# Altium schematic sheet PWR_MCU.SchDoc
size 420 x 297 mm; Address1: Address1; Address2: Address2; Address3: Address3; Address4: Address4; DocumentNumber: АБВГ.123456.001 Э3; SheetNumber: 1; SheetTotal: 2; Scale: 1:1; DocumentType: Схема электрическая принципиальная; FirstReferrence: АБВГ.123456.001
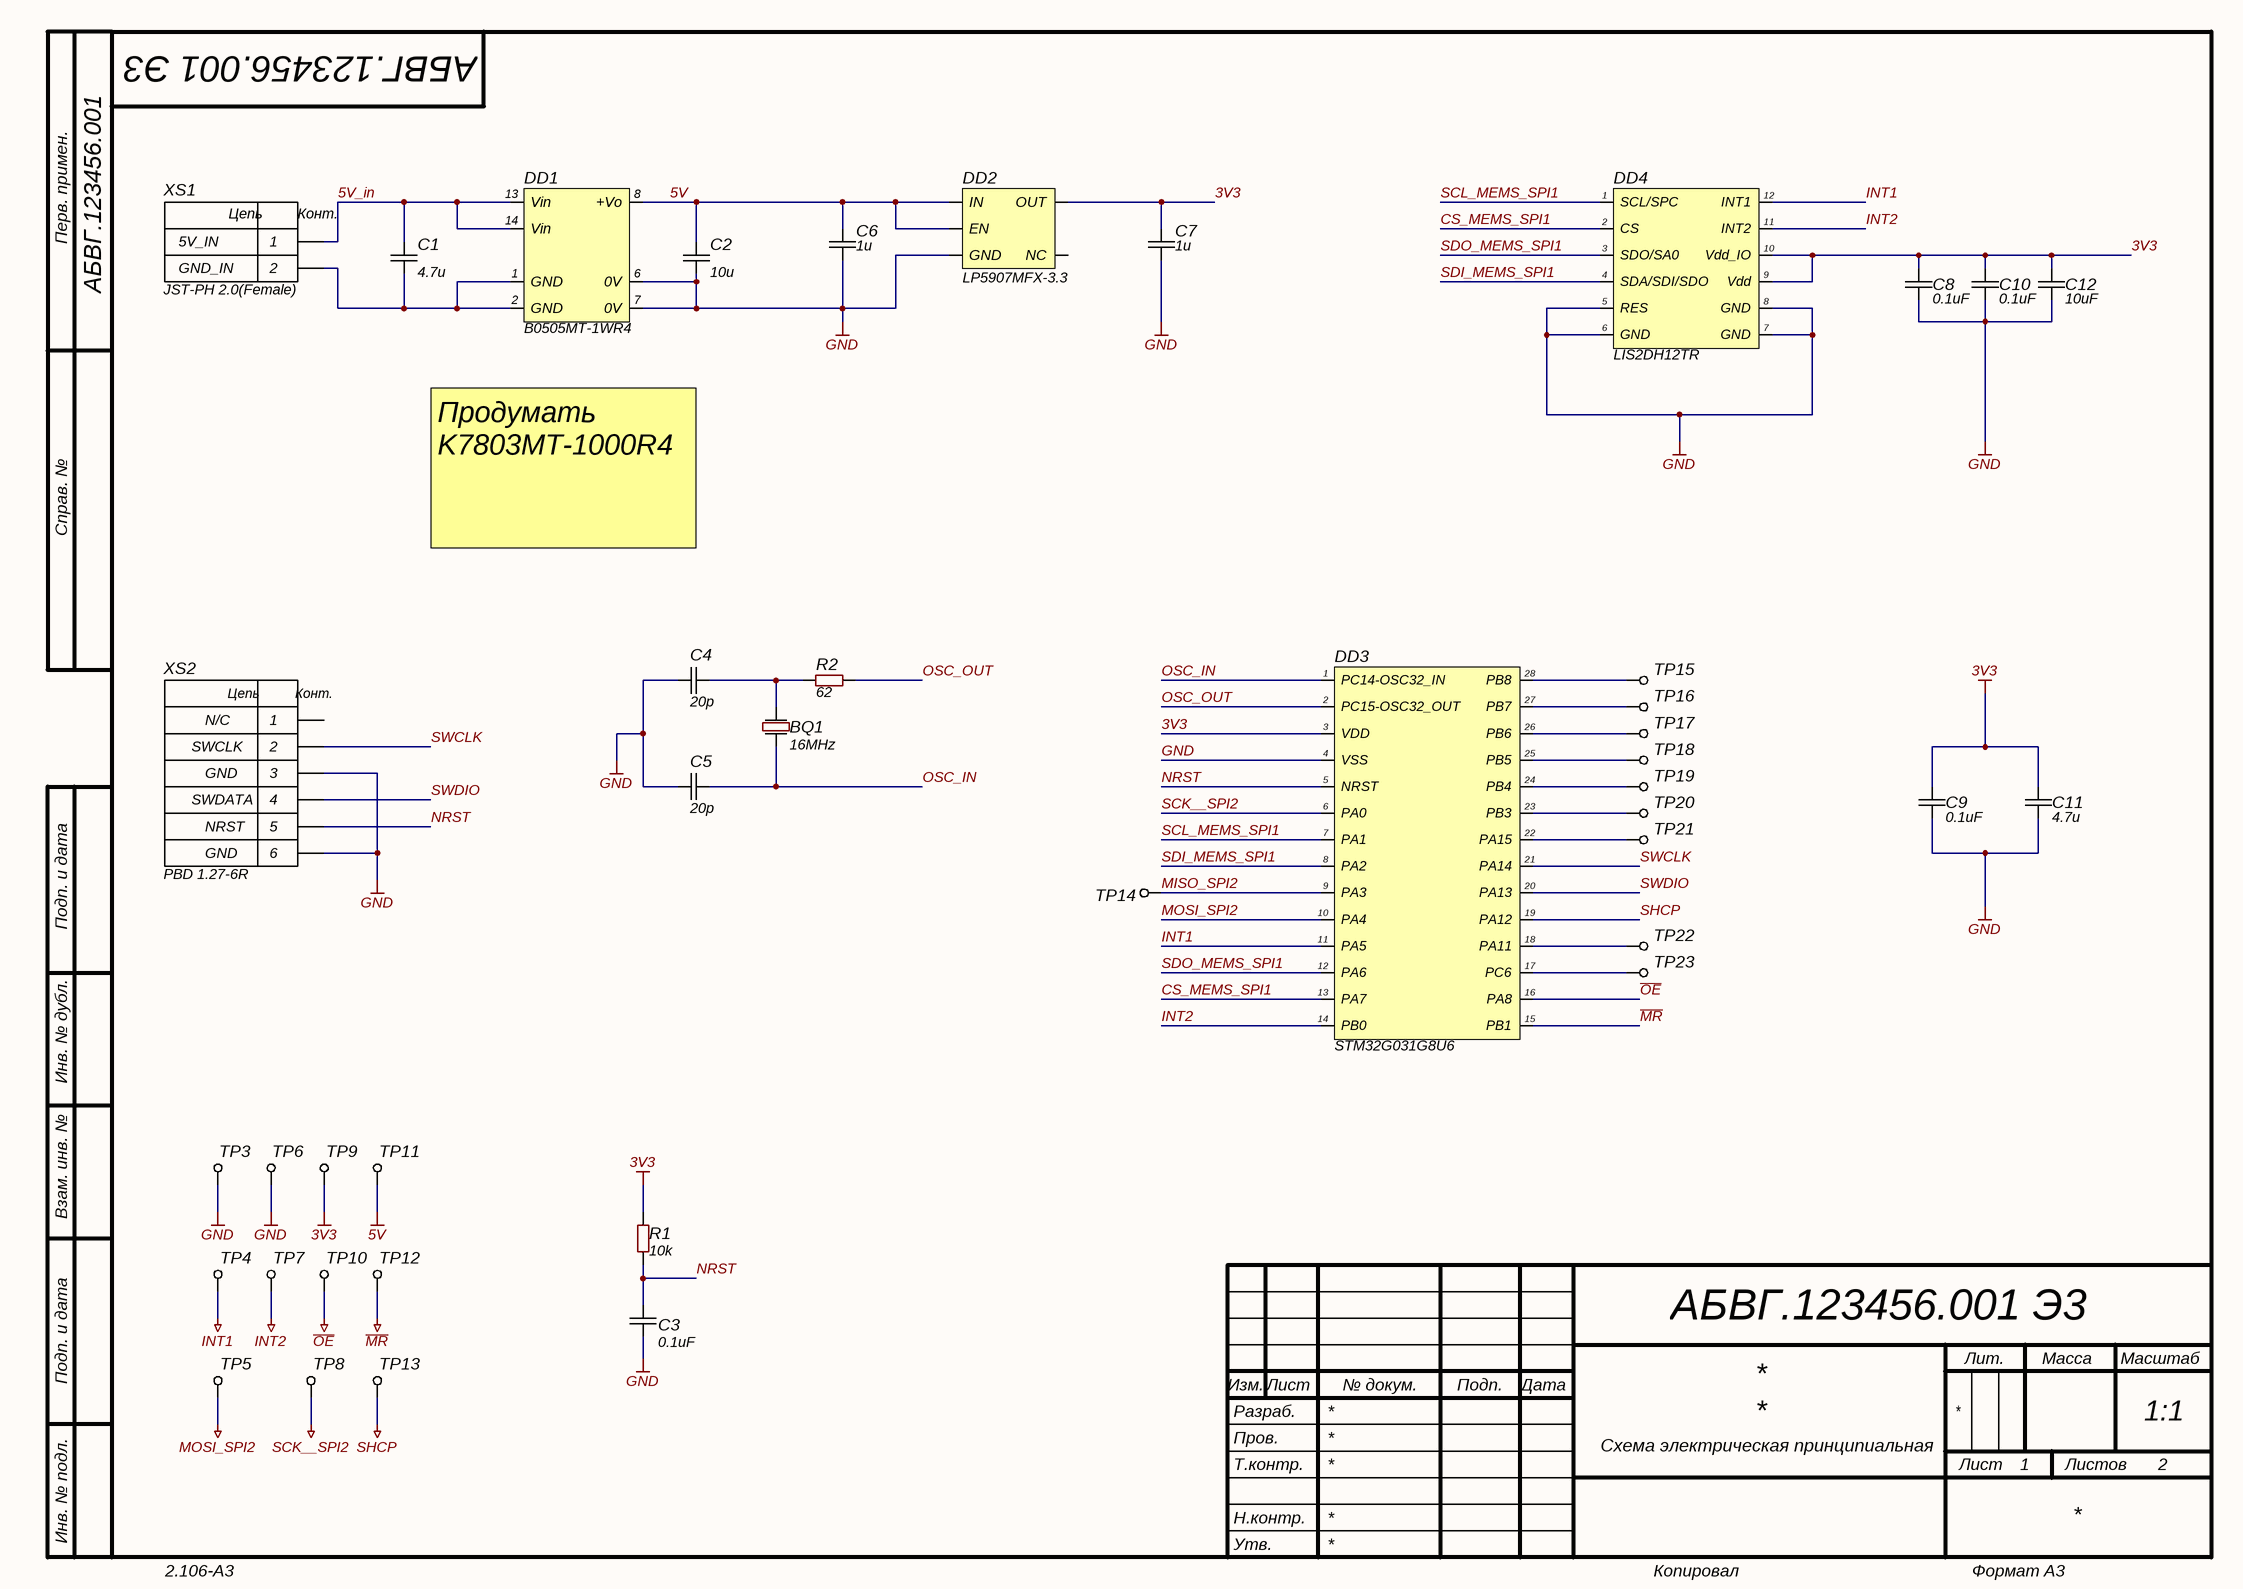
[diagram p0: PWR_MCU.SchDoc]

## Parts
BQ1  Frequency: 16MHz  [OSC: 3225]  (hidden comment: SMD3225-16.000MHz)
C1  value 4.7u  [CAP: 0805]
C2  value 10u  [CAP: 0805]
C3  value 0.1uF  [CAP: 0603]
C4  value 20p  [CAP: 0603]  (hidden comment: 0603   20 пФ ± 10 % X7R 10В)
C5  value 20p  [CAP: 0603]  (hidden comment: 0603   20 пФ ± 10 % X7R 10В)
C6  value 1u  [CAP: 0603]  (hidden comment: 0603   1 мкФ ± 10 % X7R 16В)
C7  value 1u  [CAP: 0603]  (hidden comment: 0603   1 мкФ ± 10 % X7R 16В)
C8  value 0.1uF  [CAP: 0603]
C9  value 0.1uF  [CAP: 0603]
C10  value 0.1uF  [CAP: 0603]
C11  value 4.7u  [CAP: 0603]
C12  value 10uF  [CAP: 0603]
DD1  B0505MT-1WR4  [B0505MT-1WR4]
DD2  LP5907MFX-3.3  [SOT23-5]
DD3  STM32G031G8U6  [28-UFQFPN]
DD4  LIS2DH12TR  [12-LGA]
R1  value 10k  [RES: 0603]
R2  value 62  [RES: 0603]  (hidden comment: 0603 62 Ом ± 5 %)
TP3  Testpoint_HS1mm  [TestPoint(without hole)]  (value not drawn)
TP4  Testpoint_HS1mm  [TestPoint(without hole)]  (value not drawn)
TP5  Testpoint_HS1mm  [TestPoint(without hole)]  (value not drawn)
TP6  Testpoint_HS1mm  [TestPoint(without hole)]  (value not drawn)
TP7  Testpoint_HS1mm  [TestPoint(without hole)]  (value not drawn)
TP8  Testpoint_HS1mm  [TestPoint(without hole)]  (value not drawn)
TP9  Testpoint_HS1mm  [TestPoint(without hole)]  (value not drawn)
TP10  Testpoint_HS1mm  [TestPoint(without hole)]  (value not drawn)
TP11  Testpoint_HS1mm  [TestPoint(without hole)]  (value not drawn)
TP12  Testpoint_HS1mm  [TestPoint(without hole)]  (value not drawn)
TP13  Testpoint_HS1mm  [TestPoint(without hole)]  (value not drawn)
TP14  Testpoint_HS1mm  [TestPoint(without hole)]  (value not drawn)
TP15  Testpoint_HS1mm  [TestPoint(without hole)]  (value not drawn)
TP16  Testpoint_HS1mm  [TestPoint(without hole)]  (value not drawn)
TP17  Testpoint_HS1mm  [TestPoint(without hole)]  (value not drawn)
TP18  Testpoint_HS1mm  [TestPoint(without hole)]  (value not drawn)
TP19  Testpoint_HS1mm  [TestPoint(without hole)]  (value not drawn)
TP20  Testpoint_HS1mm  [TestPoint(without hole)]  (value not drawn)
TP21  Testpoint_HS1mm  [TestPoint(without hole)]  (value not drawn)
TP22  Testpoint_HS1mm  [TestPoint(without hole)]  (value not drawn)
TP23  Testpoint_HS1mm  [TestPoint(without hole)]  (value not drawn)
XS1  JST-PH 2.0(Female)  [JST-PH 2.0(Female)]
XS2  PBD 1.27-6R  [CON: PLLD-6R(1.27)]

## Nets
3V3: C7.2 C8.2 C9.2 C10.2 C11.2 C12.2 DD2.5(OUT) DD3.3(VDD) DD4.9(Vdd) DD4.10(Vdd_IO) R1.2 TP9.1
5V: C2.2 C6.2 DD1.8(+Vo) DD2.1(IN) DD2.3(EN) TP11.1
GND: C2.1 C3.1 C4.2 C5.2 C6.1 C7.1 C8.1 C9.1 C10.1 C11.1 C12.1 DD1.6(0V) DD1.7(0V) DD2.2(GND) DD3.4(VSS) DD4.5(RES) DD4.6(GND) DD4.7(GND) DD4.8(GND) TP3.1 TP6.1 XS2.3 XS2.6
INT1: DD3.11(PA5) DD4.12(INT1) TP4.1
INT2: DD3.14(PB0) DD4.11(INT2) TP7.1
~{MR}: DD3.15(PB1) TP12.1
MOSI_SPI2: DD3.10(PA4) TP5.1
~{OE}: DD3.16(PA8) TP10.1
SCK__SPI2: DD3.6(PA0) TP8.1
SHCP: DD3.19(PA12) TP13.1
5V_in: C1.2 DD1.13(Vin) DD1.14(Vin) XS1.1
CS_MEMS_SPI1: DD3.13(PA7) DD4.2(CS)
MISO_SPI2: DD3.9(PA3) TP14.1
NRST: C3.2 DD3.5(NRST) R1.1 XS2.5
OSC_IN: BQ1.1 C5.1 DD3.1(PC14-OSC32_IN)
OSC_OUT: DD3.2(PC15-OSC32_OUT) R2.1
SCL_MEMS_SPI1: DD3.7(PA1) DD4.1(SCL/SPC)
SDI_MEMS_SPI1: DD3.8(PA2) DD4.4(SDA/SDI/SDO)
SDO_MEMS_SPI1: DD3.12(PA6) DD4.3(SDO/SA0)
SWCLK: DD3.21(PA14) XS2.2
SWDIO: DD3.20(PA13) XS2.4
NetBQ1_3: BQ1.3 C4.1 R2.2
NetC1_1: C1.1 DD1.1(GND) DD1.2(GND) XS1.2
NetDD3_17: DD3.17(PC6) TP23.1
NetDD3_18: DD3.18(PA11) TP22.1
NetDD3_22: DD3.22(PA15) TP21.1
NetDD3_23: DD3.23(PB3) TP20.1
NetDD3_24: DD3.24(PB4) TP19.1
NetDD3_25: DD3.25(PB5) TP18.1
NetDD3_26: DD3.26(PB6) TP17.1
NetDD3_27: DD3.27(PB7) TP16.1
NetDD3_28: DD3.28(PB8) TP15.1

Not connected (* = marked no-connect by the designer): DD2 4(NC); XS2 1

## Notes on the sheet
- 5V_IN
- GND_IN
- Продумать K7803MT-1000R4
- N/C
- SWCLK
- SWDATA
- GND
- NRST
- Перв. примен.
- Справ. №
- Подп. и дата
- Инв. № дубл.
- Взам. инв. №
- Разраб.
- Изм.
- Лист
- № докум.
- Подп.
- Дата
- Лит.
- Масса
- Масштаб
- Пров.
- Т.контр.
- Листов
- Инв. № подл.
- Утв.
- Н.контр.
- 2.106-A3
- Копировал
- Формат А3
- (in symbol JST-PH 2.0(Female)) Цепь; Конт.
- (in symbol PBD 1.27-6R) Цепь; Конт.

## Library data of the parts
BQ1 = Crystal_3225: Resonator; Manufacturer: Diodes Incorporated; PartNumber: FL1000002; ValueManufacturerPartNumber: Crystal, 16MHz, 12pF, ±25ppm, case 3225, -40...+85°C; LoadCapacitance: 12pF; Tolerance: ±25ppm; Package: case 3225; HelpURL: https://www.digikey.com/product-detail/en/diodes-incorporated/FL1000002/FL1000002CT-ND/6042078; Temperature: -40...+85°C; TypeOscilator: Crystal
C1 = Ceramic_0805: Manufacturer: Yageo; PartNumber: CC0805KRX7R7BB104; ValueManufacturerPartNumber: Ceramic capacitor, 4.7u, X7R, ±10%, 50V, 0805, -55...+125°C; TypeCapacitor: Ceramic capacitor; Tolerance: ±10%; TypeDielectric: X7R; Voltage: 50V; Package: 0805; HelpURL: https://www.digikey.com/product-detail/en/yageo/CC0805KRX7R7BB104/311-1142-1-ND/303052; Temperature: -55...+125°C
C2 = Ceramic_0805: Manufacturer: Yageo; PartNumber: CC0805KRX7R7BB104; ValueManufacturerPartNumber: Ceramic capacitor, 10u, X7R, ±10%, 50V, 0805, -55...+125°C; TypeCapacitor: Ceramic capacitor; Tolerance: ±10%; TypeDielectric: X7R; Voltage: 50V; Package: 0805; HelpURL: https://www.digikey.com/product-detail/en/yageo/CC0805KRX7R7BB104/311-1142-1-ND/303052; Temperature: -55...+125°C
C3 C8-C10 = Ceramic_0603: Manufacturer: Yageo; PartNumber: CC0603KRX7R7BB104; ValueManufacturerPartNumber: Ceramic capacitor, 0.1uF, X7R, ±10%, 16V, 0603, -55...+125°C; TypeCapacitor: Ceramic capacitor; Tolerance: ±10%; TypeDielectric: X7R; Voltage: 16V; Package: 0603; HelpURL: https://www.digikey.com/product-detail/en/yageo/CC0603KRX7R7BB104/311-1088-1-ND/302998; Temperature: -55...+125°C
C4 C5 = Ceramic_0603: Capacitor; Manufacturer: Yageo; PartNumber: CC0603KRX7R7BB104; ValueManufacturerPartNumber: Ceramic capacitor, 20p, X7R, ±10%, 16V, 0603, -55...+125°C; TypeCapacitor: Ceramic capacitor; Tolerance: ±10%; Voltage: 16V; Package: 0603; HelpURL: https://www.digikey.com/product-detail/en/yageo/CC0603KRX7R7BB104/311-1088-1-ND/302998; Temperature: -55...+125°C; TypeDielectric: X7R
C6 C7 = Ceramic_0603: Capacitor; Manufacturer: Yageo; PartNumber: CC0603KRX7R7BB104; ValueManufacturerPartNumber: Ceramic capacitor, 1u, X7R, ±10%, 16V, 0603, -55...+125°C; TypeCapacitor: Ceramic capacitor; Tolerance: ±10%; Voltage: 16V; Package: 0603; HelpURL: https://www.digikey.com/product-detail/en/yageo/CC0603KRX7R7BB104/311-1088-1-ND/302998; Temperature: -55...+125°C; TypeDielectric: X7R
C11 = Ceramic_0603: Manufacturer: Yageo; PartNumber: CC0603KRX7R7BB104; ValueManufacturerPartNumber: Ceramic capacitor, 4.7u, X7R, ±10%, 16V, 0603, -55...+125°C; TypeCapacitor: Ceramic capacitor; Tolerance: ±10%; TypeDielectric: X7R; Voltage: 16V; Package: 0603; HelpURL: https://www.digikey.com/product-detail/en/yageo/CC0603KRX7R7BB104/311-1088-1-ND/302998; Temperature: -55...+125°C
C12 = Ceramic_0603: Manufacturer: Yageo; PartNumber: CC0603KRX7R7BB104; ValueManufacturerPartNumber: Ceramic capacitor, 10uF, X7R, ±10%, 16V, 0603, -55...+125°C; TypeCapacitor: Ceramic capacitor; Tolerance: ±10%; TypeDielectric: X7R; Voltage: 16V; Package: 0603; HelpURL: https://www.digikey.com/product-detail/en/yageo/CC0603KRX7R7BB104/311-1088-1-ND/302998; Temperature: -55...+125°C
DD1 = B0505MT-1WR4: Isolated DC-DC converter; ComponentLink1Description: Datasheet; ComponentLink1URL: https://www.mornsunpower.ru/html/pdf/B0505MT-1WR4.html
DD2 = LP5907MFX-3.3: LDO; ComponentLink1Description: Datasheet; ComponentLink1URL: https://www.ti.com/lit/ds/symlink/lp5907.pdf?ts=1629438025263&ref_url=https%253A%252F%252Fwww.google.com%252F
DD3 = STM32G031G8U6: Cortex-M0+; ComponentLink1Description: Documentation; ComponentLink1URL: https://www.st.com/en/microcontrollers-microprocessors/stm32g031g8.html
DD4 = LIS2DH12TR: MEMS accelerometer; ComponentLink1Description: Datasheet; ComponentLink1URL: https://estore.st.com/en/lis2dh12tr-cpn.html
R1 = Resistor_0603: Manufacturer: Yageo; PartNumber: RC0603JR-07100RL; TypeResistor: Resistor film; Power: 0.1W; Package: 0603; HelpURL: https://www.digikey.com/product-detail/en/yageo/RC0603JR-07100RL/311-100GRCT-ND/729644; ValueManufacturerPartNumber: =TypeResistor+', '+Value+', '+Tolerance+', '+Package+', '+Power+', '+Temperature; Temperature: -55...+125°C
R2 = Resistor_0603: Resistor; Manufacturer: Yageo; PartNumber: RC0603JR-07100RL; ValueManufacturerPartNumber: Resistor film, 62, ±5%, 0603, 0.1W, -55...+125°C; TypeResistor: Resistor film; Power: 0.1W; Tolerance: ±5%; Package: 0603; HelpURL: https://www.digikey.com/product-detail/en/yageo/RC0603JR-07100RL/311-100GRCT-ND/729644; Temperature: -55...+125°C
XS2 = PBD 1.27-6R: DS1065-14-2X3S8BR